# EasyEDA Pro project ProPrj_fly_ctrl_2024-12-07.epro, board fly_ctrl1
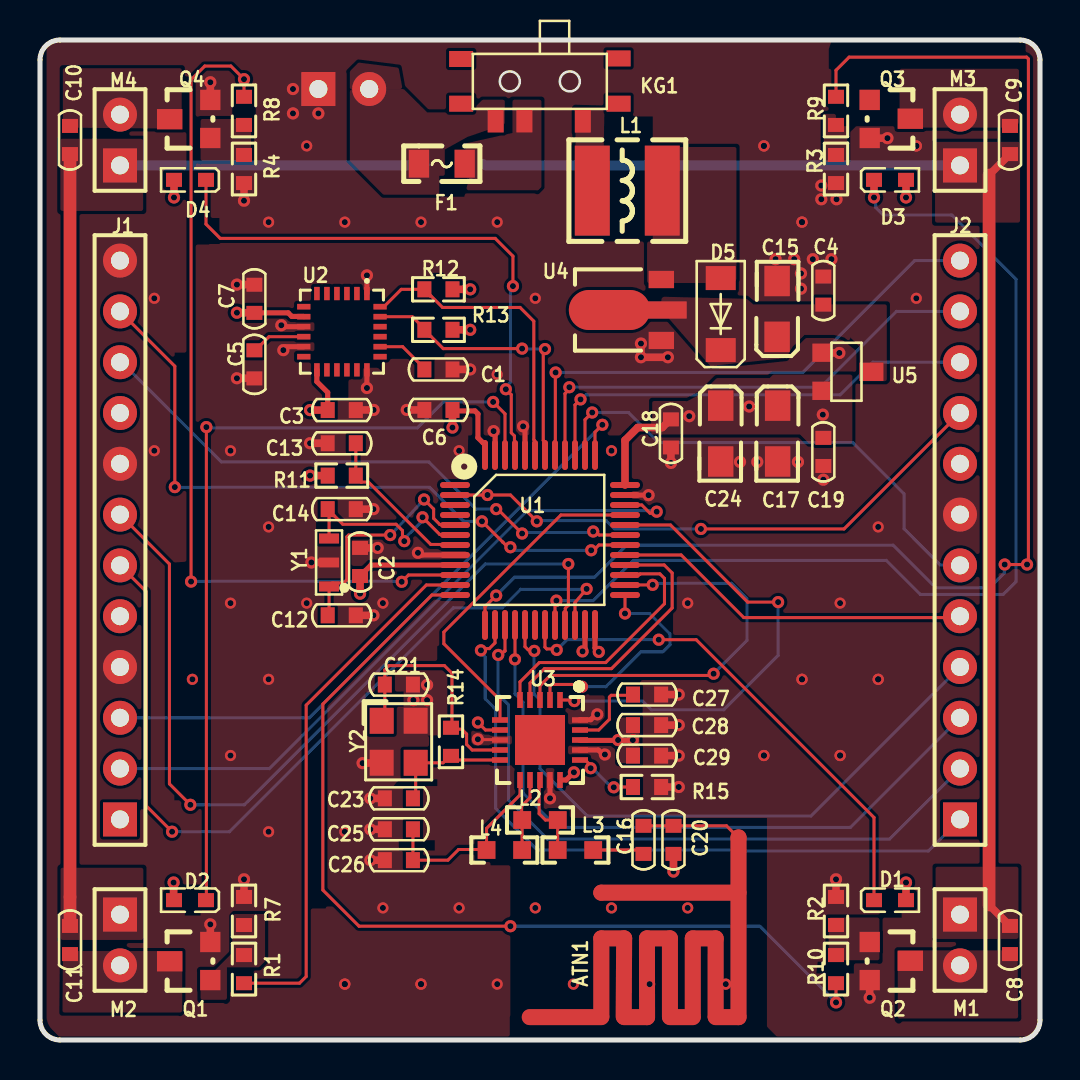
[diagram p3: board, top side]
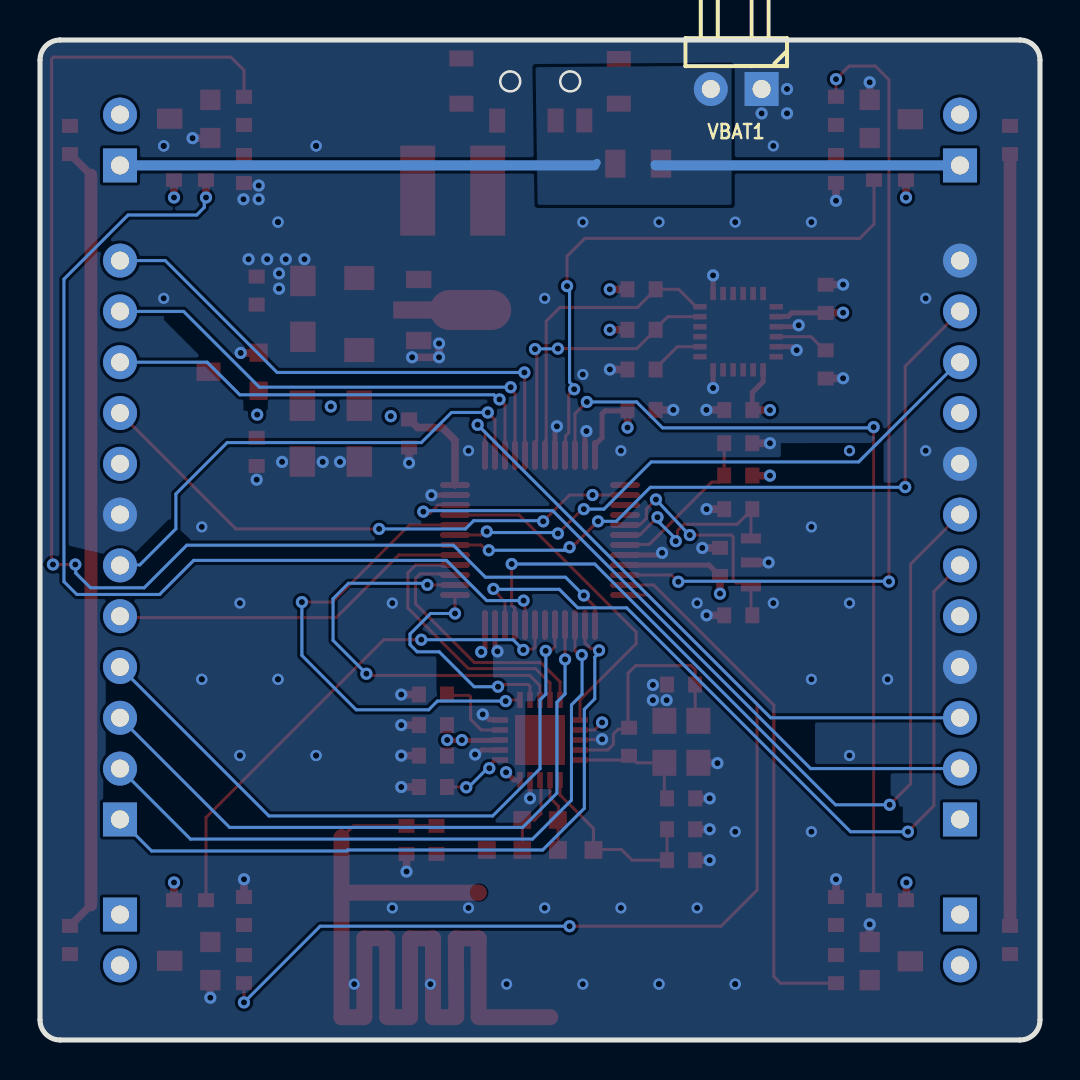
[diagram p4: board, bottom side, seen from below]

Outline 50 x 50 mm; copper layers: Top Layer, GND, PWD, Bottom Layer. Coordinates in mm from the lower left corner of the outline.
Outline path: 0,49 0,1 arc(0.29,0.29) 1,0 49,0 arc(49.71,0.29) 50,1 50,49 arc(49.71,49.71) 49,50 1,50 arc(0.29,49.71) 0,49
Stack: Top Layer 0.0356mm / Dielectric 1 0.0711mm PP-006 er 4.1 / GND 0.035mm / Dielectric 2 0.32mm FR-4 er 4.8 / PWD 0.035mm / Dielectric 3 0.0711mm PP-006 er 4.1 / Bottom Layer 0.0356mm

## Design rules (mm)
spacing Clearance (default): track to track 0.152, other pairs 0.152 to 0.254
track width Width_PWR: min 0.254, default 0.381, max 0.508
track width Width (default): min 0.152, default 0.152, max 0.152
differential pair DiffPairsRouting (default): width min 0.381, default 0.381, max 0.381; gap min 0.254, default 0.254
via RoutingVias (default): diameter min 0.61, default 0.61, max 0.61; hole min 0.305, default 0.305, max 0.305

## Placement (name value [footprint] x y rotation side)
ATN1  ANT2.4G  [ANT2.4G_1]  34.93 10.16 180 top
C1  2.2nF  [C_0603]  19.92 33.53 0 top
C2  104  [C_0603]  16 23.9 270 top
C3  104  [C_0603]  15.09 31.5 0 top
C4  104  [C_0603]  39.17 37.47 270 top
C5  104  [C_0603]  10.72 33.78 90 top
C6  104  [C_0603]  19.92 31.5 180 top
C7  0.01uF  [C_0603]  10.72 37.06 270 top
C8  104  [C_0603]  48.5 5 90 top
C9  104  [C_0603]  48.5 45 270 top
C10  104  [C_0603]  1.5 45 270 top
C11  104  [C_0603]  1.5 5 90 top
C12  20PF  [C_0603]  15.09 21.23 0 top
C13  104  [C_0603]  15.09 29.84 180 top
C14  20PF  [C_0603]  15.09 26.54 180 top
C15  100pF  [C_1206]  36.86 36.56 90 top
C16  1.5pF  [C_0603]  30.18 10.01 270 top
C17  100pF  [C_1206]  36.88 30.32 270 top
C18  104  [C_0603]  31.55 30.33 270 top
C19  104  [C_0603]  39.17 29.41 90 top
C20  1pF  [C_0603]  31.67 10.01 270 top
C21  20pF  [C_0603]  17.94 17.77 180 top
C23  20pF  [C_0603]  17.94 12.08 180 top
C24  100pF  [C_1206]  34.04 30.32 270 top
C25  22pF  [C_0603]  17.94 10.54 180 top
C26  4.7pF  [C_0603]  17.94 8.99 180 top
C27  33nF  [C_0603]  30.35 17.27 180 top
C28  4.7uF  [C_0603]  30.35 15.75 180 top
C29  104  [C_0603]  30.35 14.22 180 top
D1  R_LED  [LED0603]  42.5 6.99 180 top
D2  R_LED  [LED0603]  7.5 6.99 0 top
D3  B_LED  [LED0603]  42.5 43.01 180 top
D4  B_LED  [LED0603]  7.5 43.01 0 top
D5  S4  [SOD-123]  34.04 36.3 270 top
F1  1A  [FU 0805]  20.09 43.81 0 top
J1  12P 2.54MM  [HDR2.54-LI-12P]  4 25 90 top
J2  12P 2.54MM  [HDR2.54-LI-12P]  46 25 90 top
KG1  SW-SPDT  [TPKG]  24.99 47.52 180 top
L1  47uH  [L_CD43]  29.37 42.47 0 top
L2  8.2nH  [L_0603]  25 11 0 top
L3  3.9nH  [L_0603]  26.77 9.5 0 top
L4  2.7nH  [L_0603]  23.22 9.5 0 top
M1  720  [HDR2.54-LI-2P]  46 5 270 top
M2  720  [HDR2.54-LI-2P]  4 5 270 top
M3  720  [HDR2.54-LI-2P]  46 45 90 top
M4  720  [HDR2.54-LI-2P]  4 45 90 top
Q1  SI2302  [SOT23]  7.5 3.95 90 top
Q2  SI2302  [SOT23]  42.5 3.95 270 top
Q3  SI2302  [SOT23]  42.5 46.05 270 top
Q4  SI2302  [SOT23]  7.5 46.05 90 top
R1  10K  [R_0603]  10.2 3.54 270 top
R2  10K  [R_0603]  39.8 6.45 270 top
R3  10K  [R_0603]  39.8 43.55 90 top
R4  10K  [R_0603]  10.2 43.55 90 top
R7  10K  [R_0603]  10.2 6.45 270 top
R8  10K  [R_0603]  10.2 46.46 90 top
R9  10K  [R_0603]  39.8 46.46 90 top
R10  10K  [R_0603]  39.8 3.54 270 top
R11  10K  [R_0603]  15.09 28.22 180 top
R12  10K  [R_0603]  19.92 37.53 0 top
R13  10K  [R_0603]  19.92 35.51 0 top
R14  10K  [R_0603]  20.55 14.91 90 top
R15  10K  [R_0603]  30.35 12.65 0 top
U1  STM32F103C8T6_LQFP48  [LQFP48_STM32]  25 25 0 top
U2  MPU6050  [QFN24]  15.1 35.42 270 top
U3  NRF24L01  [LQFP32]  25 15 270 top
U4  BL8530  [SOT-89]  29.77 36.5 90 top
U5  662K  [SOT23-PIN132]  40.33 33.4 270 top
VBAT1  DC4.2V  [HDR2.54-WI-2P]  15.19 47.55 0 bottom
Y1  8MHZ  [Y3213]  14.45 23.88 90 top
Y2  16MHZ  [OSC 3225-4P]  17.93 14.91 270 top

## Footprints (pads in the part's own frame, mm; a bottom-side part is the same pattern mirrored in y, then rotated)
ANT2.4G_1
  round 0.8 smd: 1(0,0.051) 2(6.858,2.794)
C_0603
  rect 0.7x0.8 smd: 1(-0.703,0) 2(0.703,0)
C_1206
  rect 1.524x1.27 smd: 1(-1.397,0) 2(1.397,0)
FU 0805
  rect 1.016x1.397 smd: 1(-1.143,0) 2(1.143,0)
HDR2.54-LI-2P
  rect 1.7x1.7 hole 0.9: 1(-1.27,0)
  round 1.7 hole 0.9: 2(1.27,0)
HDR2.54-LI-12P
  rect 1.7x1.7 hole 0.9: 1(-13.97,0)
  round 1.7 hole 0.9: 2(-11.43,0) 3(-8.89,0) 4(-6.35,0) 5(-3.81,0) 6(-1.27,0) 7(1.27,0) 8(3.81,0) 9(6.35,0) 10(8.89,0) 11(11.43,0) 12(13.97,0)
HDR2.54-WI-2P
  rect 1.7x1.7 hole 0.9: 1(-1.27,0)
  round 1.7 hole 0.9: 2(1.27,0)
L_0603
  rect 0.889x0.889 smd: 1(-0.889,0) 2(0.889,0)
L_CD43
  rect 1.75x4.5 smd: 1(-1.75,0) 2(1.75,0)
LED0603
  rect 0.8x0.7 smd: 1(-0.8,0) 2(0.8,0)
LQFP32
  rect 2.5x2.5 smd: 0(0,0)
  rect 0.8x0.28 smd: 1(-2,1) 2(-2,0.5) 3(-2,0) 4(-2,-0.5) 5(-2,-1) 11(2,-1) 12(2,-0.5) 13(2,0) 14(2,0.5) 15(2,1)
  rect 0.28x0.8 smd: 6(-1,-2) 7(-0.5,-2) 8(0,-2) 9(0.5,-2) 10(1,-2) 16(1,2) 17(0.5,2) 18(0,2) 19(-0.5,2) 20(-1,2)
LQFP48_STM32
  oval 1.5x0.3 smd: 1(-4.25,2.75) 2(-4.25,2.25) 3(-4.25,1.75) 4(-4.25,1.25) 5(-4.25,0.75) 6(-4.25,0.25) 7(-4.25,-0.25) 8(-4.25,-0.75) 9(-4.25,-1.25) 10(-4.25,-1.75) 11(-4.25,-2.25) 12(-4.25,-2.75) 25(4.25,-2.75) 26(4.25,-2.25) 27(4.25,-1.75) 28(4.25,-1.25) 29(4.25,-0.75) 30(4.25,-0.25) 31(4.25,0.25) 32(4.25,0.75) 33(4.25,1.25) 34(4.25,1.75) 35(4.25,2.25) 36(4.25,2.75)
  oval 0.3x1.5 smd: 13(-2.75,-4.25) 14(-2.25,-4.25) 15(-1.75,-4.25) 16(-1.25,-4.25) 17(-0.75,-4.25) 18(-0.25,-4.25) 19(0.25,-4.25) 20(0.75,-4.25) 21(1.25,-4.25) 22(1.75,-4.25) 23(2.25,-4.25) 24(2.75,-4.25) 37(2.75,4.25) 38(2.25,4.25) 39(1.75,4.25) 40(1.25,4.25) 41(0.75,4.25) 42(0.25,4.25) 43(-0.25,4.25) 44(-0.75,4.25) 45(-1.25,4.25) 46(-1.75,4.25) 47(-2.25,4.25) 48(-2.75,4.25)
OSC 3225-4P
  rect 1.3x1.2 smd: 1(-1.05,-0.85) 2(1.05,-0.85) 3(1.05,0.85) 4(-1.05,0.85)
QFN24
  rect 0.665x0.28 smd: 1(-1.907,1.25) 2(-1.907,0.75) 3(-1.907,0.25) 4(-1.907,-0.25) 5(-1.907,-0.75) 6(-1.907,-1.25) 13(1.907,-1.25) 14(1.907,-0.75) 15(1.907,-0.25) 16(1.907,0.25) 17(1.907,0.75) 18(1.907,1.25)
  rect 0.28x0.665 smd: 7(-1.25,-1.907) 8(-0.75,-1.907) 9(-0.25,-1.907) 10(0.25,-1.907) 11(0.75,-1.907) 12(1.25,-1.907) 19(1.25,1.907) 20(0.75,1.907) 21(0.25,1.907) 22(-0.25,1.907) 23(-0.75,1.907) 24(-1.25,1.907)
R_0603
  rect 0.7x0.8 smd: 1(-0.703,0) 2(0.703,0)
SOD-123
  rect 1.2x1.5 smd: 1(-1.8,0) 2(1.8,0)
SOT23
  rect 1.016x1.016 smd: 1(-0.953,-1.016) 3(0.953,-1.016)
  rect 1.016x1.27 smd: 2(-0.013,1.016)
SOT23-PIN132
  rect 0.914x0.914 smd: 1(-0.962,-1.256) 2(0.944,-1.256)
  rect 0.914x1.2 smd: 3(-0.009,1.244)
SOT-89
  rect 0.864x1.27 smd: 1(-1.524,-1.296) 3(1.524,-1.296)
  oval 2x4.064 smd: 2(0,1.296)
  rect 0.864x2.54 smd: 2(0,-1.296)
TPKG
  rect 1.2x0.8 smd: 0(-3.937,0.708) 0(-3.937,-1.553) 0(3.937,0.708) 0(3.937,-1.528)
  rect 0.8x1.2 smd: 1(-2.148,1.553) 2(0.773,1.546) 3(2.21,1.546)
Y3213
  rect 0.5x1 smd: 1(-1.2,0) 2(0,0) 3(1.2,0)

## Nets
As in the schematic.

Pads without a net: KG1 0; U1 1 3 4 18; U2 2 3 4 5 6 7 12 14 15 16 17 19 21 22; U3 0

## Via types
v1: diameter 0.61, hole 0.305, Top Layer to Bottom Layer, 136 vias
v2: diameter 0.559, hole 0.305, Top Layer to Bottom Layer, 52 vias

## Routing (per net, layer and track width the routed paths; a pad name or vN(x,y) marks a point on that pad's centre or on a via; arc(x,y) is an arc through that point)
3.3V: length 34.3
  Top Layer w0.152: 6.68,6.99 D2.1 ; U3.18 27.02,14.98 ; v1(21.9,15.88) 21.9,15.88 22.27,15.5 U3.7 ; 29.65,14.17 C29.2 ; 29.62,15.23 29.64,15.21
  Top Layer w0.254: C2.2 16.05,23.2 16.28,23.42 16.28,23.47 16.55,23.75 20.75,23.75 U1.9 ; U1.24 27.75,19.6 v1(27.94,19.41) ; v1(26.7,13.39) 26.31,13 U3.15 ; U1.48 22.25,29.84 22.23,29.86 22.15,29.86 21.9,30.11 21.9,31.31 21.75,31.45 20.67,31.45 C6.1 ; C3.1 14.38,32.38 13.84,32.92 13.84,33.5 U2.13 ; U2.8 13.18,36.18 12.59,36.18 12.41,36.36 C7.2 ; 27.02,14.98 29.62,14.98
  Top Layer w0.381: v1(13.5,28.22) R11.2 ; v1(20.62,30.62) C6.1 ; U1.36 29.25,29.99 29.89,30.62 31.11,30.62 31.34,30.85 31.34,30.87 31.5,31.03 C18.1 ; v1(9.85,36.36) 10.73,36.36 ; v1(6.7,42.13) D4.1 ; v1(13.5,31.5) C3.1 ; 6.68,6.99 v1(6.68,7.87) ; v1(43.3,42.13) D3.1 ; D1.1 v1(43.3,7.87) ; 20.63,37.53 v1(21.51,37.53) ; 20.63,35.51 v1(21.51,35.51) ; v1(16,22.32) C2.2
  vias: v1(28.91,15) v1(29.64,15) v1(32.46,31.19) v1(35.46,31.67) v1(39.14,31.27)
GND: length 41.3
  Top Layer w0.152: v1(21.9,15.04) 21.91,15.02 22.98,15.02 U3.8
  Top Layer w0.254: 12.28,34.67 U2.11 ; U1.47 22.76,30.43 ; U2.1 v1(16.35,38.23) ; U1.44 24.25,30.65 ; v1(25.5,12.08) U3.14 ; v1(28.25,14.28) 28.14,14.28 27.92,14.5 U3.17 ; v1(27.13,19.43) 27.25,19.55 U1.23 ; U1.35 v1(30.43,27.24) ; v1(18.9,24.36) 18.99,24.36 19.1,24.25 U1.8 ; v1(16.35,32.6) U2.18 ; 12.28,35.67 U2.9 ; v1(27.86,16.28) 27.81,16.28 27.54,16.01 27.01,16.01 U3.20
  Top Layer w0.381: 15.8,31.5 v1(16.68,31.5) ; Q1.3 v1(8.52,5.78) ; v1(13.57,23.88) Y1.2 ; v1(31.55,28.85) C18.2 ; v1(16.52,8.99) 17.24,8.99 ; C12.2 v1(16.67,21.23) ; C2.1 v1(16.88,24.6) ; U5.1 39.09,34.35 v1(39.97,34.35) ; v1(10.2,41.96) R4.1 ; v1(31.67,8.42) C20.2 ; R7.1 v1(10.2,8.04) ; C29.1 v1(31.94,14.22) ; Q4.3 v1(8.52,47.89) ; C27.1 v1(31.94,17.27) ; v1(18.34,31.5) C6.2 ; C14.1 v1(16.67,26.54) ; R2.1 v1(39.8,8.04) ; v1(16.52,10.54) 17.24,10.54 ; v1(13.5,29.84) C13.2 ; R15.2 v1(31.94,12.65) ; C28.1 v1(31.94,15.75) ; v1(30.05,34.82) v1(30.05,34.14) v1(31.39,34.14) ; C1.2 v1(21.51,33.53) ; Q3.3 41.49,45.09 v1(42.37,45.09) ; v1(9.85,37.77) 10.73,37.77 ; v1(41.48,2.11) Q2.3 ; v1(9.85,33.09) 10.73,33.09 ; v1(16.13,13.84) Y2.2 ; v1(16.52,12.08) 17.24,12.08
  vias: v1(12.06,35.74) v1(12.17,34.49) v1(12.65,47.55) v1(12.65,46.33) v1(13.92,46.33) v1(18.67,16.99) v1(19.35,17.75) v1(19.35,16.99) v1(22.68,30.44) v1(24.16,30.68) v1(35,28.91) v1(35.87,28.91) v1(36.78,39.04) v1(37.71,39.04) v1(37.9,28.91) v1(38.05,38.33) v1(38.05,37.57) v1(38.64,39.04) v1(39.06,42.72) v1(39.06,42.04) v1(39.17,28.02) v1(39.57,39.04) v1(39.83,42.04) v2(5.72,37.08) v2(5.72,29.46) v2(7.62,18.03) v2(9.53,29.46) v2(9.53,21.84) v2(9.53,14.22) v2(11.43,40.89) v2(11.43,25.65) v2(11.43,18.03) v2(11.43,10.41) v2(13.34,44.7) v2(13.34,21.84) v2(15.24,40.89) v2(15.24,10.41) v2(15.24,2.79) v2(15.24,2.79) v2(17.15,21.84) v2(17.15,6.6) v2(19.05,40.89) v2(19.05,2.79) v2(19.05,2.79) v2(20.96,29.46) v2(20.96,6.6) v2(22.86,40.89) v2(22.86,33.27) v2(22.86,2.79) v2(24.76,37.08) v2(24.76,6.6) v2(26.67,2.79) v2(28.57,29.46) v2(28.57,6.6) v2(30.48,2.79) v2(32.38,21.84) v2(32.38,6.6) v2(34.29,2.79) v2(36.19,44.7) v2(36.19,44.7) v2(36.19,14.22) v2(36.19,14.22) v2(38.1,40.89) v2(38.1,40.89) v2(38.1,18.03) v2(38.1,18.03) v2(40,21.84) v2(40,14.22) v2(40,14.22) v2(41.91,25.65) v2(41.91,18.03) v2(41.91,18.03) v2(43.81,44.7) v2(43.81,44.7) v2(43.81,37.08)
VBAT: length 117.3
  Top Layer w0.381: 47.45,6.75 C8.2 ; 47.45,43.25 C9.2
  Top Layer w0.635: 47.45,6.75 47.45,43.25 ; C11.2 C10.2
  Bottom Layer w0.381: 22.15,43.87 22.28,43.73 ; 19.22,43.73 19.28,43.79
  Bottom Layer w0.508: M4.1 19.22,43.73 ; 22.28,43.73 M3.1
CE: length 24.2
  Top Layer w0.152: U1.32 31.53,25.75 35.38,21.89 v1(36.91,21.89) ; U3.1 26.66,17 v1(26.72,16.95) 26.77,16.89
  Bottom Layer w0.152: v1(36.91,21.89) 36.91,19.23 34.19,16.51 30.56,16.51 30.13,16.95 v1(26.72,16.95)
CSN: length 11.8
  Top Layer w0.152: v1(27.1,17.66) 27.01,17.75 26.81,17.75 26.78,17.78 25.59,17.78 25.5,17.69 U3.2 ; v1(29.25,21.33) U1.25
  Bottom Layer w0.152: v1(29.25,21.33) 30.47,21.33 31.5,20.3 31.5,19.77 31.14,19.41 30.04,19.41 28.29,17.66 v1(27.1,17.66)
LED1: length 25.6
  Top Layer w0.152: D1.2 41.7,11.12 32.81,20.02 v1(30.94,20.02) ; U1.19 25.25,20.75 25.25,19.64 25.34,19.55 25.79,19.55 v1(25.84,19.5)
  Bottom Layer w0.152: 30.89,20.02 26.35,20.02 v1(25.84,19.5)
LED2: length 41.5
  Top Layer w0.152: v1(22.66,31.9) 23.25,31.31 U1.46 ; D2.2 8.32,7.01 v1(8.32,30.64)
  Bottom Layer w0.152: v1(22.66,31.9) 20.17,31.9 18.87,30.61 8.36,30.61 v1(8.32,30.64) 8.28,30.68
LED3: length 51.1
  Top Layer w0.152: U1.20 25.75,21.9 v1(25.82,21.97)
  Top Layer w0.381: v1(41.7,42.13) D3.2
  Bottom Layer w0.152: v1(25.82,21.97) 27.66,21.97 29.67,23.98 42.31,23.98 44.02,22.28 48.16,22.28 48.8,22.92 48.8,38.04 45.59,41.25 42.16,41.25 41.79,41.63 41.79,42.04 v1(41.7,42.13)
LED4: length 28.5
  Top Layer w0.152: D4.2 8.3,40.79 9.01,40.08 22.76,40.08 23.65,39.19 v1(23.65,37.69) ; U1.45 23.72,29.28 23.72,30.2 23.56,30.36 23.56,32.27 v1(23.29,32.54)
  Bottom Layer w0.152: v1(23.65,37.69) 23.65,37.57 23.52,37.45 23.52,32.89 23.29,32.66 v1(23.29,32.54)
MISO: length 13.1
  Top Layer w0.152: U3.5 24,17.9 24.97,18.87 28.28,18.87 31.22,21.81 31.22,23.08 31,23.31 30.01,23.31 29.98,23.28 29.28,23.28 U1.27
MOSI: length 13.8
  Top Layer w0.152: U1.28 31.21,23.75 31.61,23.35 31.61,21.6 28.57,18.57 25.22,18.57 24.5,17.84 U3.4
NETATN1_1: length 5
  Top Layer w0.152: C16.1 C20.1 34.32,10.71 ATN1.1
NETC1_1: length 2.7
  Top Layer w0.152: U2.20 18.13,34.67 19.22,33.58 C1.1
NETC5_2: length 2.8
  Top Layer w0.152: U2.10 11.45,35.17 10.77,34.48 C5.2
NETC11_1: length 0.4
  Top Layer w0.152: 3.61,3.73 M2.2
NETC16_2: length 2.6
  Top Layer w0.152: C16.2 29.98,9.5 L3.2
NETC21_2: length 12.2
  Top Layer w0.152: U3.9 21.61,14.5 21.33,14.78 21.33,15.3 21.09,15.54 20.62,15.54 R14.2 ; 20.6,15.61 20.6,18.34 20.22,18.72 17.45,18.72 17.24,18.51 17.24,16.12 Y2.1
NETC23_1: length 6.3
  Top Layer w0.152: U3.10 20.76,14 R14.1 20.5,14.21 20.15,13.86 Y2.3 18.78,12.22 C23.1
NETC25_1: length 9.6
  Top Layer w0.152: L4.1 22.33,10.58 24,12.25 U3.11 ; 22.3,9.53 20.93,9.53 20.4,8.99 C26.1 C25.1
NETC27_2: length 4
  Top Layer w0.152: C27.2 29.61,17.23 28.56,17.23 28.47,17.15 28.47,16.03 27.93,15.5 U3.19
NETL2_1: length 3.7
  Top Layer w0.152: L4.2 24.1,10.99 L2.1 24.08,11.03 24.08,11.69 24.5,12.11 U3.12
NETL2_2: length 4.3
  Top Layer w0.152: L3.1 25.88,10.99 L2.2 25.27,11 24.96,11.32 24.96,12.96 U3.13
NETQ4_1: length 0
  Top Layer w0.152: 10.15,45.75 R8.1
NETR15_1: length 3.3
  Top Layer w0.152: v1(28.69,12.64) 28.7,12.65 R15.1 ; U3.16 27.26,14 27.45,13.81 27.45,13.68 v1(27.53,13.59)
  Bottom Layer w0.152: v1(27.53,13.59) 27.62,13.59 28.58,12.64 v1(28.69,12.64)
NRF_IRQ: length 17
  Top Layer w0.152: U3.6 23,17 20.19,19.81 20.19,20.4 26.05,26.25 U1.33
OSC_IN: length 11.7
  Top Layer w0.152: U1.5 20.72,25.78 19.99,25.78 19.68,26.08 19.68,26.55 v1(19.2,27.03) ; v1(17.51,25.25) 15.43,25.25 15.34,25.16 15.34,23.01 15.18,22.85 14.63,22.85 Y1.1 14.45,21.3 C12.1
  Bottom Layer w0.152: v1(19.2,27.03) 17.53,25.25 v1(17.51,25.25)
OSC_OUT: length 9.7
  Top Layer w0.152: U1.6 20.72,25.28 19.98,25.28 v1(19.13,26.14) ; Y1.3 14.45,26.42 ; 14.45,26.42 14.38,26.49 C14.2 ; 14.45,26.42 14.66,26.22 14.71,26.22 15.14,25.79 17.8,25.79 18.12,25.47 18.12,25.03 v1(18.21,24.94)
  Bottom Layer w0.152: v1(19.13,26.14) 19.04,26.05 19.04,25.88 18.99,25.83 18.26,25.11 18.21,25.06 v1(18.21,24.94)
PA4: length 34.7
  Top Layer w0.152: U1.14 22.75,19.85 22.47,19.57 22.13,19.57 v1(22.05,19.48)
  Bottom Layer w0.152: v1(22.05,19.48) 22.05,19.36 22.26,19.14 22.26,17.06 22.78,16.54 22.78,11.58 24.87,9.5 34.62,9.5 34.67,9.45 44.42,9.45 J2.1
PA5: length 34
  Top Layer w0.152: U1.15 23.25,19.45 23.24,19.45 23.23,19.45 23.03,19.25 v1(22.91,19.25)
  Bottom Layer w0.152: v1(22.91,19.25) 22.9,19.24 22.9,17.29 23.43,16.76 23.43,11.99 25.38,10.04 42.47,10.04 J2.2
PA6: length 33.4
  Top Layer w0.152: 23.75,18.99 U1.16
  Bottom Layer w0.152: v1(23.75,19.03) 23.75,17.3 24.16,16.89 24.16,12.34 25.87,10.63 40.52,10.63 J2.3
PA7: length 32.7
  Top Layer w0.152: v1(24.71,19.46) 24.66,19.51 24.41,19.51 24.25,19.67 U1.17
  Bottom Layer w0.152: 24.71,19.41 24.71,17.29 25,17 25,13.57 27.37,11.2 38.55,11.2 J2.4
PA8: length 18.1
  Top Layer w0.152: J2.5 45.93,21.12 35.19,21.12 32.06,24.25 U1.29
PA15: length 24.9
  Top Layer w0.152: v1(27.61,31.38) 27.25,31.01 U1.38
  Bottom Layer w0.152: J2.6 45.98,23.75 45.01,23.75 43.21,25.56 43.21,27.31 40.64,29.87 30.93,29.87 29.43,31.38 v1(27.61,31.38)
PB3: length 22.6
  Top Layer w0.152: U1.39 26.75,31.75 v1(27.03,32.03)
  Bottom Layer w0.152: v1(27.03,32.03) 27.07,32.03 27.3,32.26 40.01,32.26 41.64,33.89 J2.10
PB4: length 24.6
  Top Layer w0.152: U1.40 26.25,32.32 26.47,32.54 v1(26.47,32.64)
  Bottom Layer w0.152: J2.11 42.82,36.43 39.03,32.64 26.47,32.64 v1(26.47,32.64)
PB5: length 26.6
  Top Layer w0.152: 25.77,33.34 25.77,29.27 U1.41
  Bottom Layer w0.152: J2.12 43.74,38.97 38.14,33.38 v1(25.78,33.38)
PC13: length 28.4
  Top Layer w0.152: U1.2 v1(22.37,27.25) 23.52,27.25 24.3,26.47 v1(24.84,25.93) ; v1(33.05,25.55) 40.2,25.55 J2.9
  Bottom Layer w0.152: v1(24.84,25.93) 24.87,25.97 28.31,25.97 28.73,25.55 v1(33.05,25.55)
PWM1: length 42.5
  Top Layer w0.152: v1(7.55,22.92) 7.55,48.01 8.24,48.7 9.54,48.7 v1(10.2,48.04) R8.2 ; U1.10 18.42,23.25 v1(18.09,22.91)
  Bottom Layer w0.152: v1(7.55,22.92) 7.57,22.94 18.06,22.94 v1(18.09,22.91)
PWM2: length 26.7
  Top Layer w0.152: R1.2 12.97,2.84 13.31,3.17 13.31,16.74 19.32,22.75 U1.11
PWM3: length 47.1
  Top Layer w0.152: v1(39.8,1.88) 39.8,1.88 R10.2 ; v1(23.52,5.69) 15.95,5.69 14.14,7.5 14.14,16.8 19.59,22.25 U1.12
  Bottom Layer w0.152: v1(39.8,1.88) 35.99,5.69 v1(23.52,5.69)
PWM4: length 67.5
  Top Layer w0.152: v1(22.81,22.22) 22.25,21.67 U1.13 ; v1(48.23,23.77) v1(49.35,23.77) 49.42,23.84 49.42,49.05 49.33,49.14 40.46,49.14 39.8,48.49 R9.2
  Bottom Layer w0.152: v1(48.23,23.77) 48.21,23.75 48.21,23.35 47.48,22.61 44.79,22.61 42.66,24.74 29.33,24.74 29.24,24.65 27.73,23.14 23.72,23.14 v1(22.81,22.22)
RST: length 8
  Top Layer w0.152: U1.7 20.72,24.78 19.54,24.78 16.42,27.9 16.06,27.9 15.79,28.17 C13.1
RXD1: length 28.9
  Top Layer w0.152: v1(24.1,25.32) 22.89,26.54 v1(22.81,26.54) ; v1(27.66,25.43) 27.78,25.43 27.96,25.25 U1.31
  Bottom Layer w0.152: J1.10 4.08,33.89 9.07,28.91 19.44,28.91 21.8,26.54 v1(22.81,26.54) ; v1(24.1,25.32) 24.16,25.37 27.61,25.37 v1(27.66,25.43)
RXD3: length 42.2
  Top Layer w0.152: v1(27.33,22.56) 26.79,21.92 arc(26.79,21.92) 26.79,21.92 26.75,21.87 U1.22 ; J1.6 5.31,22.42 5.31,11.71 v1(6.6,10.41)
  Bottom Layer w0.152: v1(6.6,10.41) 9.47,10.41 20.67,21.61 23.11,21.61 24.03,22.53 27.31,22.53 v1(27.33,22.56)
SCK: length 20.5
  Top Layer w0.152: U1.26 29.25,22.75 30.63,22.75 v1(30.63,22.76) ; v1(33.68,18.31) 33.59,18.23 25.51,18.23 25.09,17.8 25,17.72 U3.3
  Bottom Layer w0.152: v1(33.68,18.31) 35.35,19.98 35.35,22.06 34.58,22.83 30.71,22.83 v1(30.63,22.76)
SCL: length 14.3
  Top Layer w0.152: v1(25.25,34.55) 25.25,34.42 25.16,34.33 25.16,29.98 25.25,29.89 U1.42 ; U2.23 18.61,36.17 19.22,35.56 R13.1 19.22,35.46 19.49,35.19 19.54,35.19 20.16,34.57 v1(24.1,34.57)
  Bottom Layer w0.152: v1(24.1,34.57) 24.12,34.56 25.24,34.56 v1(25.25,34.55)
SDA: length 15.5
  Top Layer w0.152: U1.43 24.72,29.28 24.72,29.98 24.69,30.01 24.69,35.94 24,36.63 20.13,36.63 19.54,37.21 19.49,37.21 19.22,37.48 R12.1 18.06,37.53 17.2,36.67 U2.24
SWCLK: length 31.9
  Top Layer w0.152: U1.37 27.75,30.39 v1(28.12,30.76)
  Bottom Layer w0.152: J1.3 13.47,16.11 28.12,30.77
SWDIO: length 33.7
  Top Layer w0.152: U1.34 30.09,26.75 30.5,26.34 30.76,26.34 v1(30.84,26.42)
  Bottom Layer w0.152: J1.2 11.47,13.57 24.36,26.47 30.56,26.47
TXD1: length 33.9
  Top Layer w0.152: 6.73,27.64 v1(6.74,27.65) 6.74,33.69 J1.11 ; v1(23.52,24.64) 23.4,24.64 23.14,24.89 23.14,24.89 v1(22.1,25.93) ; v1(27.56,24.49) 27.68,24.49 27.95,24.75 U1.30 29.23,24.73
  Bottom Layer w0.152: v1(22.1,25.93) 21.18,25.93 19.48,27.64 6.73,27.64 ; v1(23.52,24.64) 23.64,24.64 23.8,24.49 v1(27.56,24.49)
TXD3: length 43
  Top Layer w0.152: J1.7 6.47,23.8 6.47,12.81 v1(7.52,11.76) ; U1.21 26.26,20.76 26.26,21.58 26.42,21.74 26.42,23.8 v1(26.42,23.8)
  Bottom Layer w0.152: v1(7.52,11.76) 10.22,11.76 22.26,23.8 v1(26.42,23.8)

## Copper pours and planes (outline as drawn; the poured copper is in the pictures)
3.3V on Top Layer: 30,16.13 29.97,16.1 29.97,13.84 28.93,13.84 28.91,13.87 28.91,16.13
3.3V on Top Layer: 30.61,31.04 30.56,30.99 30.56,30.28 38,30.28 38.46,29.82 40.61,29.82 40.61,33.27 36.65,33.27 36.47,33.1 33.83,33.1 33.02,32.28
3.3V on Top Layer: 32.62,31.95 30.61,31.95 30.61,30.68 30.56,30.63
3.3V on PWD: 0.51,49.49 49.49,49.49 49.49,0.51 0.51,0.51
4.2V on Top Layer: 26.77,46.61 26.77,44.35 27.94,44.35 28.42,43.87 28.42,46.56
5V on Top Layer: 40.94,33.07 41.07,32.94 42.29,32.94 42.34,32.99 42.34,36.78 35.66,36.78 35.61,36.83 35.33,37.06 31.17,37.16 31.07,37.06 31.07,36.5 33.35,33.88 33.53,33.71 37.3,34.1 37.63,34.66 38.23,35.25 39.68,35.25 40.21,35.13 40.97,34.53 40.97,33.1
GND on Top Layer: 0.33,1.18 0.4,0.83 0.6,0.53 0.95,0.18 49.33,0.18 49.68,0.25 49.98,0.45 50.33,0.8 50.33,49.18 50.04,49.88 49.33,50.18 0.95,50.18 0.51,50 0.33,49.56
GND on Top Layer: 17.68,14.5 15.19,14.5 15.19,8.64 17.7,8.64
GND on Top Layer: 30.51,29.64 30.51,28.47 31.24,27.03 40.84,27.03 40.87,27.15 40.87,29.31 38.15,29.31 37.69,29.77 30.71,29.77
GND on Top Layer: 36.3,39.52 36.3,37.21 38.33,37.21 38.89,37.77 40.16,37.77 40.16,39.68
GND on Top Layer: 14.88,44.6 11.66,44.6 11.35,44.91 11.35,48.51 14.88,48.51
GND on Top Layer: 29.13,35.1 29.13,32.97 29.18,32.92 31.9,32.92 31.9,35 31.8,35.1
GND on Top Layer: 40.16,39.63 40.16,43.23 39.83,43.21 38.51,43.1 38.51,39.52
GND on Top Layer: 18.19,18.17 18.19,15.3 19.81,15.3 19.81,18.17
GND on Bottom Layer: 0,1 0.07,0.65 0.27,0.35 0.62,0 49,0 49.35,0.07 49.65,0.27 50,0.62 50,49 49.71,49.71 49,50 0.62,50 0.18,49.82 0,49.38
GND on GND: 0.51,49.49 49.49,49.49 49.49,0.51 0.51,0.51
VBAT on Top Layer: 1,5 1.03,5.03 1.03,8.61 5.17,8.61 5.17,5
VBAT on Top Layer: 16.46,47.55 16.43,47.52 15.49,47.52 15.49,43.94 17.17,42.27 19.96,42.27 20.24,42.55 20.24,44.53 21.39,45.16 23.24,45.8 23.24,47.02 22.12,47.02 21.44,46.33 21.39,46.38 19.35,46.38 18.19,47.55
VBAT on Top Layer: 5.18,45.06 5.16,45.03 5.16,41.45 1.02,41.45 1.02,45.06
VBAT on Top Layer: 18.19,47.55 18.11,47.62 17.93,48.62 15.93,48.87 15.47,48.41 15.49,48.39 15.49,47.52
VBAT on Top Layer: 44.75,40.87 44.75,44.91 49,44.91 49,40.87
VBAT on Top Layer: 44.75,5.05 44.78,5.08 44.78,8.66 48.92,8.66 48.92,5.05
VBAT on Bottom Layer: 15.47,48.72 15.42,48.67 15.42,41.76 25.12,41.76 25.22,48.64
NETC8_1 on Top Layer: 48.88,4.41 48.81,4.48 42.89,4.48 42.89,1.03 42.94,0.98 43.04,1.08 48.91,1.08
NETC9_1 on Top Layer: 42.93,45.62 48.72,45.62 48.95,45.85 48.95,48.74 43,48.74 42.85,48.59
NETC10_1 on Top Layer: 7.09,45.57 7.09,48.59 1.14,48.59 1.14,45.62
NETC11_1 on Top Layer: 1.15,4.44 7.11,4.44 7.11,1.45 7.01,1.35 6.98,1.37 1.12,1.37
NETD5_1 on Top Layer: 30.35,42.34 30.35,37.85 34.65,37.85 34.82,38.02 34.82,44.65 30.43,44.65
NETF1_2 on Top Layer: 21.23,43.81 21.23,42.53 21.32,42.53 21.28,42.49 24.82,42.49 24.87,42.44 25.07,42.65 25.07,47.02 23.62,47.02 23.62,45.36 21.28,44.83
NETQ1_1 on Top Layer: 8,3.45 8.03,3.43 8.03,2.01 9.25,2.01 9.3,1.96 9.35,2.01 9.35,3.63 10.95,3.63 11.25,3.94 11.25,6.3 9.72,6.3 9.62,6.2 9.62,4.36 8.71,3.45
NETQ2_1 on Top Layer: 41.97,6.12 39.41,6.12 39.43,6.1 39.43,3.99 41.95,3.99 41.97,3.96
NETQ3_1 on Top Layer: 41.94,47.35 41.96,47.33 41.96,46.25 41.15,46.25 40.36,45.46 40.36,43.9 39.19,43.9 39.19,46.3 40.36,46.3
NETQ4_1 on Top Layer: 10.57,46.08 10.54,46.05 8.03,46.05 8.03,43.94 8.05,43.97 10.54,43.97

Small or netless copper shapes (teardrops, artwork), in the pictures only: 1 on Top Layer
